# Altium schematic sheet High Pass Filter.SchDoc: High Pass Filter
size A; DocumentNumber: 5; SheetNumber: 5; SheetTotal: 9
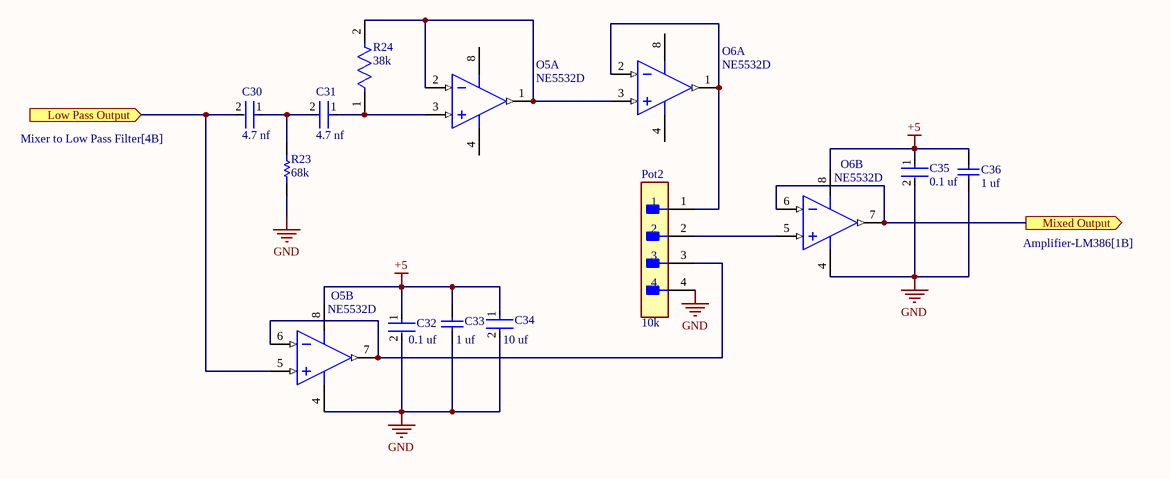
[diagram p0: High Pass Filter.SchDoc]

## Parts
C30  4.7 nf  [FP-RCEWM1-MFG]
C31  4.7 nf  [FP-RCEWM1-MFG]
C32  0.1 uf  [FP-CL21-IPC_A]
C33  1 uf  [CAPC2013X145X50LL20T25]
C34  10 uf  [FP-C0805C-DG-MFG]
C35  0.1 uf  [FP-CL21-IPC_A]
C36  1 uf  [CAPC2013X145X50LL20T25]
O5  NE5532D  [D0008A_L]  (parts A,B of 2)
O6  NE5532D  [D0008A_L]  (parts A,B of 2)
Pot2  10k  [FP-B4B-XH-A_LF_SN-MFG]
R23  68k  [RESC2013X70X40LL20T20]
R24  38k  [FP-ERJ6EN-MFG]

## Ports
Low Pass Output (in, see Mixer to Low Pass Filter[4B]), Mixed Output (out, see Amplifier-LM386[1B])

## Nets
+5: C32.1 C33.1 C34.1 C35.1 C36.1 O5.8(VCC+) O6.8(VCC+)
GND: C32.2 C33.2 C34.2 C35.2 C36.2 O5.4(VCC-) O6.4(VCC-) Pot2.4 R23.2
Low Pass Output: C30.2 O5.5(IN2+) ; port Low Pass Output
Mixed Output: O6.6(IN2-) O6.7(OUT2) ; port Mixed Output
NetC30_1: C30.1 C31.2 R23.1
NetC31_1: C31.1 O5.3(IN1+) R24.1
NetO5_1: O5.1(OUT1) O5.2(IN1-) O6.3(IN1+) R24.2
NetO5_6: O5.6(IN2-) O5.7(OUT2) Pot2.3
NetO6_1: O6.1(OUT1) O6.2(IN1-) Pot2.1
NetO6_5: O6.5(IN2+) Pot2.2

## Notes on the sheet
- Title
- Size
- Date:
- A
- Drawn By:
- Sheet    of
- Revision
- File:
- Document Number:

## Library data of the parts
C30 C31 = CMP-06035-003622-1: CAP CER 22UF 25V X7R RADIAL; Tolerance: 20%; Lead Diameter: 0.5mm; Lead/Base Style: Formed Leads; Height - Seated (Max): 0.295inch; Height: 7.5mm; Capacitance: 22uF; Max Operating Temperature: 125°C; Package Quantity: 1500; Case/Package: Radial; Length: 0.217inch; Lead Pitch: 0.197inch; Voltage Rating (DC): 25V; Ratings: AEC-Q200; Mount: Through Hole; Packaging: Tape and Reel; Voltage Rating: 25V; Min Operating Temperature: -55°C; Width: 0.157inch; Resistor Type: Ceramic; Termination: Radial; Dielectric: X7R
C32 C35 = CMP-13271-003098-1: CL21 Series 0805 1uF 16V ±10% Tolerance X7R Multilayer Ceramic Chip Capacitor; Case Code (Metric): 2012; Width: 0.049inch; Thickness: 0.053inch; Voltage Rating: 16V; Max Operating Temperature: 125°C; Case Code (Imperial): 0805; Height: 1.25mm; Length: 2mm; Case/Package: 0805; Lead Free: Lead Free; Mount: Surface Mount; Capacitance: 1uF; Tolerance: 10%; Voltage Rating (DC): 16V; Min Operating Temperature: -55°C; Contact Plating: Tin; Depth: 1.25mm; Packaging: Tape and Reel; Package Quantity: 1; Voltage: 16V; Dielectric: X7R; Radiation Hardening: No
C33 C36 = CMP-1036-04746-2: Manufacturer: Kemet; Part Number: C0805C105K4PACTU
C34 = CMP-2007-03243-2: CAP CER 10UF 10V X5R 0805; Manufacturer Part Number: C0805C106K8PACTU; Manufacturer: Kemet; 3DS Part Number: 220-00001; Tolerance: 10%; Temperature Coefficient: 15%; Material: Ceramic; Device Class L2: Capacitors; Device Class L1: Passive Components; ComponentLink2URL: https://content.kemet.com/datasheets/KEM_C1006_X5R_SMD.pdf; Height: 1.4mm; Lead Free: Yes; Digikey Description: CAP CER 10UF 10V X5R 0805; Octopart: https://octopart.com/c0805c106k8pactu-kemet-98697; Capacitance: 10uF; Value: 10uF; Temperature Range Low: -55°C; Temperature: -55°C to +85°C; Automotive: No; Mouser Description: CAP CER 10UF 10V X5R 0805; Ipc Land Pattern Name: CAPC200125X125; Temperature Range High: +85°C; Voltage: 10V; RoHS: TRUE; Device Class L3: Ceramic Capacitors; ComponentLink2Description: Datasheet; Voltage Rating: 10V; Package: C0805C-DG; Temperature Characteristic: X5R; Category: Cap
O5 O6 = CMP-0015-00060-2: Dual Low-Noise High-Speed Audio Operational Amplifier, 10 to 30 V, 0 to 70 degC, 8-pin SOIC (D8), Green (RoHS & no Sb/Br); Manufacturer: Texas Instruments; GBW(Typ)(MHz): 10; Vn at 1kHz(Typ)(nV/rtHz): 5; Number of Channels: 2; Vio (25C)(Max)(mV): 4; Slew Rate(Typ)(V/us): 9; Sub Family: General Purpose Amplifier, High Supply Voltage Amplifier (>=30V), Low Noise Amp (<=10nV/rtHz); CMRR(Min)(dB): 70; Total Supply Voltage(Max)(+5V is 5, +/-5V is 10): 30; IIB(Max)(pA): 800000; ComponentLink1Description: Manufacturer URL; PackageReference: D0008A; ComponentLink1URL: http://www.ti.com/; DatasheetVersion: SLOS075I; PackageDescription: 8-Pin Plastic Small Outline, Body 4.9 x 3.9 mm, Pitch 1.27 mm; PackageVersion: 4040047-3/M, 06/2011; ComponentLink3Description: Package Specification; PartNumber: NE5532D; ComponentLink3URL: http://www.ti.com/litv/pdf/msoi002j; Iq per channel(Max)(mA): 4; Eco-Plan: Green (RoHS & no Sb/Br); ComponentLink2Description: Datasheet; Code_JEDEC: MS-012; Total Supply Voltage(Min)(+5V is 5, +/-5V is 10): 10; Mounting Technology: Surface Mount; ComponentLink2URL: http://www.ti.com/lit/ds/symlink/ne5532.pdf
Pot2 = CMP-17439-000250-1: CONN HEADER VERT 4POS 2.5MM; Number of Contacts: 4; Contact Resistance: 20mR; Voltage Rating: 250V; Max Current Rating: 3A; Gender: Male; Wire/Cable Gauge: 22AWG; Mated Stacking Heights: 9.8mm; Insulation Resistance: 1GR; Orientation: Straight; Contact Type: Male Pin; Contact Finish - Mating: TIN; Series: XH; Max Voltage Rating (AC): 250V; Lead Pitch: 2.5mm; Contact Shape: Square; Insulation Color: Natural; Termination: Solder; Lead Free: Lead Free; Voltage Rating (AC): 250V; Number of Rows: 1; Flammability Rating: UL94 V-0; Number of Positions: 4; Max Operating Temperature: 85°C; Package Quantity: 500; Mount: Through Hole; REACH SVHC: No SVHC; Connector Type: Header; Insulation Material: Nylon; Fastening Type: Detent; Min Operating Temperature: -25°C; Housing Color: White; Packaging: Bulk; Contact Plating: Tin; Contact Material: Brass; Max Voltage Rating (DC): 250V; Housing Material: Polyamide; Color: Natural; Material: Polyamide; Pitch: 2.5mm; Depth: 5.75mm; Current Rating: 3A; Length: 12.4mm
R23 = CMP-2001-00442-1: Manufacturer: Panasonic; Part Number: ERJ-6GEYJ683V
R24 = CMP-2001-00027-2: RES SMD 20K OHM 1% 1/8W 0805; Temperature Coefficient: 100ppm/°C; Voltage Rating: 150V; Power Rating: 125mW; Resistance: 20kR; Max Operating Temperature: 155°C; Number of Terminations: 2; RoHS Compliant: Yes; Case Code (Imperial): 0805; Packaging: Tape and Reel; Construction: Rectangular; Series: ERJ; Resistor Type: Thick Film; Lead Free: Lead Free; Package Quantity: 1; Case/Package: 0805; Features: Automotive AEC-Q200; REACH SVHC: No SVHC; Technology: THICK FILM; Width: 0.049inch; Length: 2mm; Depth: 1.25mm; Min Operating Temperature: -55°C; Case Code (Metric): 2012; Contact Plating: Tin; Termination: SMD/SMT; Resistance Tolerance: 1%; Height: 0.6mm; Working Voltage: 150V; Military Standard: Not; Max Power Dissipation: 125mW; Radiation Hardening: No; Tolerance: 1%; Voltage Rating (DC): 150V; Mount: Surface Mount